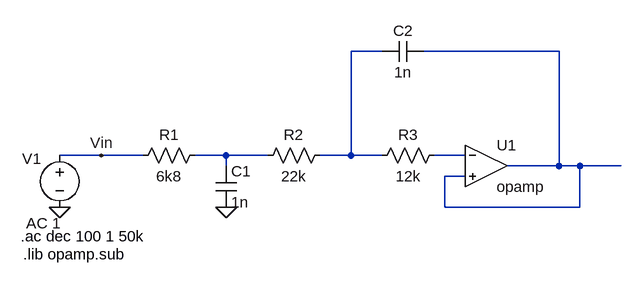
[diagram p0: schematic sallen_key_3rd_order_butterworth.asc]
sallen_key_3rd_order_butterworth.asc, the LTspice schematic file:
Version 4
SHEET 1 932 680
WIRE 560 -16 512 -16
WIRE 832 -16 624 -16
WIRE 128 144 64 144
WIRE 192 144 128 144
WIRE 320 144 272 144
WIRE 384 144 320 144
WIRE 512 144 512 -16
WIRE 512 144 464 144
WIRE 560 144 512 144
WIRE 688 144 640 144
WIRE 320 160 320 144
WIRE 832 160 832 -16
WIRE 832 160 752 160
WIRE 864 160 832 160
WIRE 928 160 864 160
WIRE 688 176 656 176
WIRE 656 224 656 176
WIRE 864 224 864 160
WIRE 864 224 656 224
FLAG 320 224 0
FLAG 128 144 Vin
FLAG 64 224 0
SYMBOL res 288 128 R90
WINDOW 0 0 56 VBottom 2
WINDOW 3 32 56 VTop 2
SYMATTR InstName R1
SYMATTR Value 6k8
SYMBOL cap 304 160 R0
SYMATTR InstName C1
SYMATTR Value 1n
SYMBOL res 480 128 R90
WINDOW 0 0 56 VBottom 2
WINDOW 3 32 56 VTop 2
SYMATTR InstName R2
SYMATTR Value 22k
SYMBOL res 656 128 R90
WINDOW 0 0 56 VBottom 2
WINDOW 3 32 56 VTop 2
SYMATTR InstName R3
SYMATTR Value 12k
SYMBOL cap 624 -32 R90
WINDOW 0 0 32 VBottom 2
WINDOW 3 32 32 VTop 2
SYMATTR InstName C2
SYMATTR Value 1n
SYMBOL voltage 64 128 R0
WINDOW 0 -58 21 Left 2
WINDOW 3 -52 92 Left 2
WINDOW 123 -52 120 Left 2
WINDOW 39 0 0 Left 0
SYMATTR InstName V1
SYMATTR Value ""
SYMATTR Value2 AC 1
SYMBOL OpAmps\\opamp 720 96 R0
SYMATTR InstName U1
TEXT 4 268 Left 2 !.ac dec 100 1 50k
TEXT 8 296 Left 2 !.lib opamp.sub

The netlist it stands for:
* sallen_key_3rd_order_butterworth.asc
R1 N003 Vin 6k8
C1 N003 0 1n
R2 N001 N003 22k
R3 N004 N001 12k
C2 N002 N001 1n
V1 Vin 0 AC 1
XU1 N004 N002 N002 opamp Aol=100K GBW=10Meg  ; pins invin noninvin out
.ac dec 100 1 50k
.lib opamp.sub
.backanno
.end